# EAGLE schematic FLYTE-v1 (EAGLE 9.6.2)
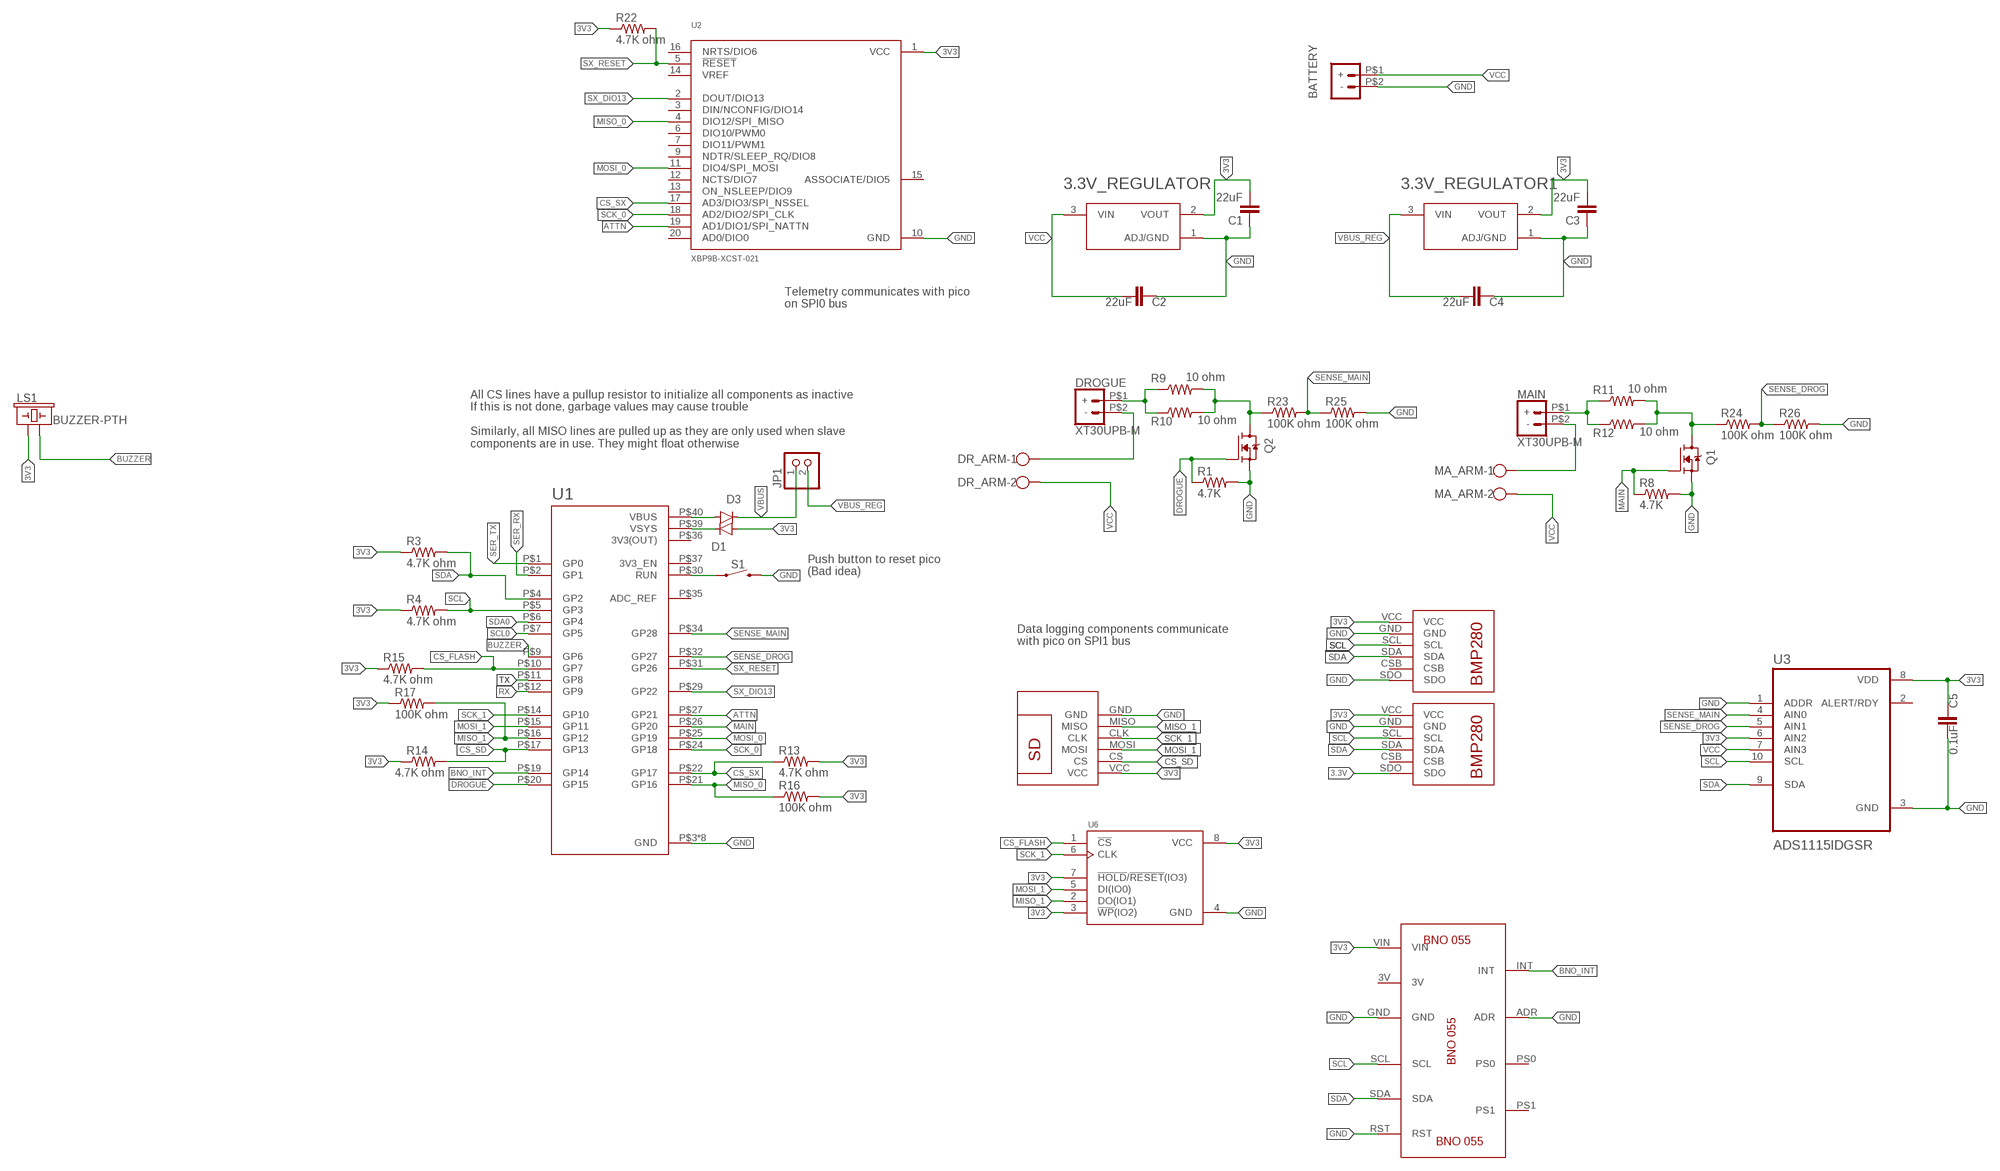
[diagram p0: schematic, sheet 1]

## Parts
3.3V_REGULATOR  AMS1117-3.3  [SOT229P700X180-4N]
3.3V_REGULATOR1  AMS1117-3.3  [SOT229P700X180-4N]
BATTERY  XT30UPB-M  [XT30UPB-M]
C1  22uF  22UF-0805-6.3V-20%  [0805]
C2  22uF  22UF-0805-6.3V-20%  [0805]
C3  22uF  22UF-0805-6.3V-20%  [0805]
C4  22uF  22UF-0805-6.3V-20%  [0805]
C5  0.1uF  22UF-0805-6.3V-20%  [0805]
D1  1N4004  [DO41-10]
D3  1N4004  [DO41-10]
DR_ARM  W237-102  [W237-102]
DROGUE  XT30UPB-M  [XT30UPB-M]
JP1  PINHD-1X2  [1X02]
LS1  BUZZER-PTH  [BUZZER-12MM]
MA_ARM  W237-102  [W237-102]
MAIN  XT30UPB-M  [XT30UPB-M]
Q1  IRF540NPBF  [TO254P1054X469X1930-3]
Q2  IRF540NPBF  [TO254P1054X469X1930-3]
R1  4.7K  R-US_R0805  [R0805]
R3  4.7K ohm  R-US_R0805  [R0805]
R4  4.7K ohm  R-US_R0805  [R0805]
R8  4.7K  R-US_R0805  [R0805]
R9  10 ohm  R-US_0207/10  [0207/10]
R10  10 ohm  R-US_0207/10  [0207/10]
R11  10 ohm  R-US_0207/10  [0207/10]
R12  10 ohm  R-US_0207/10  [0207/10]
R13  4.7K ohm  R-US_R0805  [R0805]
R14  4.7K ohm  R-US_R0805  [R0805]
R15  4.7K ohm  R-US_R0805  [R0805]
R16  100K ohm  R-US_R0805  [R0805]
R17  100K ohm  R-US_R0805  [R0805]
R22  4.7K ohm  R-US_R0805  [R0805]
R23  100K ohm  R-US_R0805  [R0805]
R24  100K ohm  R-US_R0805  [R0805]
R25  100K ohm  R-US_R0805  [R0805]
R26  100K ohm  R-US_R0805  [R0805]
S1  MOMENTARY-SWITCH-SPST-PTH-6.0MM  [TACTILE_SWITCH_PTH_6.0MM]
U1  RASPBERRY_PICO-NO_DEBUG  [PICO-PKG-NO_DEBUG]
U2  XBP9B-XCST-021  [DIP2200W51P200L3294H279Q20P]
U3  ADS1115IDGSR  [SOP50P490X110-10N]
U6  W25Q32JVSSIQ  [SOIC127P790X216-8N]
U$1  BMP280  [BMP280]
U$2  BMP280  [BMP280]
U$3  SDREADER  [SDREADER]
U$4  BNO055  [BNO055]

## Nets
3.3V: U$2.SDO
3V3: 3.3V_REGULATOR1.2(VOUT) 3.3V_REGULATOR.2(VOUT) C1.2 C3.2 C5.1 D1.A LS1.+ R3.1 R4.1 R13.2 R14.1 R15.1 R16.2 R17.1 R22.1 U2.1(VCC) U3.6(AIN2) U3.8(VDD) U6.3(!WP!(IO2)) U6.7(!HOLD!/!RESET!(IO3)) U6.8(VCC) U$1.VCC U$2.VCC U$3.VCC U$4.VIN
ATTN: U1.P$27(GP21) U2.19(AD1/DIO1/SPI_NATTN)
BNO_INT: U1.P$19(GP14) U$4.INT
BUZZER: LS1.- U1.P$9(GP6)
CS_FLASH: R15.2 U1.P$10(GP7) U6.1(!CS)
CS_SD: R14.2 U1.P$17(GP13) U$3.CS
CS_SX: R13.1 U1.P$22(GP17) U2.17(AD3/DIO3/SPI_NSSEL)
DROGUE: Q2.1(G) R1.1 U1.P$20(GP15)
GND: 3.3V_REGULATOR1.1(ADJ/GND) 3.3V_REGULATOR.1(ADJ/GND) BATTERY.P$2(-) C1.1 C2.1 C3.1 C4.1 C5.2 Q1.3(S) Q2.3(S) R1.2 R8.2 R25.2 R26.2 S1.3 U1.P$3(GND) U1.P$8(GND) U1.P$13(GND) U1.P$18(GND) U1.P$23(GND) U1.P$28(GND) U1.P$33(GND) U1.P$38(GND) U2.10(GND) U3.1(ADDR) U3.3(GND) U6.4(GND) U$1.GND U$1.SDO U$2.GND U$3.GND U$4.ADR U$4.GND U$4.RST
MAIN: Q1.1(G) R8.1 U1.P$26(GP20)
MISO_0: R16.1 U1.P$21(GP16) U2.4(DIO12/SPI_MISO)
MISO_1: R17.2 U1.P$16(GP12) U6.2(DO(IO1)) U$3.MISO
MOSI_0: U1.P$25(GP19) U2.11(DIO4/SPI_MOSI)
MOSI_1: U1.P$15(GP11) U6.5(DI(IO0)) U$3.MOSI
N$1: D1.C U1.P$39(VSYS)
N$2: DR_ARM.1 DROGUE.P$2(-)
N$6: MAIN.P$1(+) R11.1 R12.1
N$7: DROGUE.P$1(+) R9.1 R10.1
N$8: S1.1 U1.P$30(RUN)
N$12: Q2.2(D) R9.2 R10.2 R23.1
N$13: Q1.2(D) R11.2 R12.2 R24.1
N$14: MA_ARM.1 MAIN.P$2(-)
N$17: D3.A U1.P$40(VBUS)
RX: U1.P$12(GP9)
SCK_0: U1.P$24(GP18) U2.18(AD2/DIO2/SPI_CLK)
SCK_1: U1.P$14(GP10) U6.6(CLK) U$3.CLK
SCL: R4.2 U1.P$5(GP3) U3.10(SCL) U$1.SCL U$2.SCL U$4.SCL
SCL0: U1.P$7(GP5)
SDA: R3.2 U1.P$4(GP2) U3.9(SDA) U$1.SDA U$2.SDA U$4.SDA
SDA0: U1.P$6(GP4)
SENSE_DROG: R24.2 R26.1 U1.P$32(GP27) U3.5(AIN1)
SENSE_MAIN: R23.2 R25.1 U1.P$34(GP28) U3.4(AIN0)
SER_RX: U1.P$2(GP1)
SER_TX: U1.P$1(GP0)
SX_DIO13: U1.P$29(GP22) U2.2(DOUT/DIO13)
SX_RESET: R22.2 U1.P$31(GP26) U2.5(!RESET)
TX: U1.P$11(GP8)
VBUS: D3.C JP1.1
VBUS_REG: 3.3V_REGULATOR1.3(VIN) C4.2 JP1.2
VCC: 3.3V_REGULATOR.3(VIN) BATTERY.P$1(+) C2.2 DR_ARM.2 MA_ARM.2 U3.7(AIN3)
Unconnected: U1.P$35(ADC_REF) U1.P$37(3V3_EN) U2.3(DIN/NCONFIG/DIO14) U2.6(DIO10/PWM0) U2.7(DIO11/PWM1) U2.9(NDTR/SLEEP_RQ/DIO8) U2.12(NCTS/DIO7) U2.13(ON_NSLEEP/DIO9) U2.14(VREF) U2.15(ASSOCIATE/DIO5) U2.16(NRTS/DIO6) U2.20(AD0/DIO0) U3.2(ALERT/RDY) U$1.CSB U$2.CSB U$4.3V U$4.PS0 U$4.PS1

## Notes on the sheet
- Telemetry communicates with pico 
  on SPI0 bus
- All CS lines have a pullup resistor to initialize all components as inactive
  If this is not done, garbage values may cause trouble
  
  Similarly, all MISO lines are pulled up as they are only used when slave
  components are in use. They might float otherwise
- Push button to reset pico
  (Bad idea)
- Data logging components communicate 
  with pico on SPI1 bus

## Power pins joined to a net without a drawn wire
3V3(OUT): U1.P$36(3V3(OUT))

## Library data of the parts
3.3V_REGULATOR 3.3V_REGULATOR1 = AMS1117-3.3:AMS1117-3.3: Sot223/Pkg 1-Amp 3.3-Volt Low Drop Out Voltage Regulatator Check availability <https://pricing.snapeda.com/parts/AMS1117-3.3/Advanced%20Monolithic%20Systems/view-part?ref=eda>; AVAILABILITY: Not in stock; DESCRIPTION: Sot223/Pkg 1-Amp 3.3-Volt Low Drop Out Voltage Regulatator; MF: Advanced Monolithic Systems; MP: AMS1117-3.3; PACKAGE: SOT-223 Seeed Technology; PRICE: None
BATTERY DROGUE MAIN = XT30UPB-M:XT30UPB-M: Check availability <https://pricing.snapeda.com/parts/XT30UPB-M/amass/view-part?ref=eda>; AVAILABILITY: Not in stock; DESCRIPTION: Socket; DC supply; XT30; male; PIN: 2; on PCBs; THT; yellow; 15A; 500V; MF: amass; MP: XT30UPB-M; PACKAGE: None; PRICE: None
C1-C4 = SparkFun-Capacitors:22UF: 22µF ceramic capacitors A capacitor is a passive two-terminal electrical component used to store electrical energy temporarily in an electric field.; PROD_ID: CAP-08402
C5 = SparkFun-Capacitors:22UF: 22µF ceramic capacitors A capacitor is a passive two-terminal electrical component used to store electrical energy temporarily in an electric field.; PROD_ID: CAP-08402; VALUE: 22uF
D1 D3 = diode:1N4004: DIODE general purpose rectifier, 1 A
DR_ARM MA_ARM = con-wago-500:W237-102: WAGO SCREW CLAMP; MPN: 237-102; OC_FARNELL: unknown; OC_NEWARK: 70K9898
JP1 = pinhead:PINHD-1X2: PIN HEADER
LS1 = SparkFun-Electromechanical:BUZZER: Buzzer Small round buzzers that operate around the audible 2kHz range. You can use these as speakers to create simple music or user interfaces. Variant Overview: PTH - Mini Speaker - PC Mount 12mm 2.048kHz <https://www.sparkfun.com/products/7950> PTH_KIT - Mini Speaker - PC Mount 12mm 2.048kHz <https://www.sparkfun.com/products/7950> KIT simplifies soldering by adding stop mask to one side of the pads. PTH_NO_SILK - Mini Speaker - PC Mount 12mm 2.048kHz <https://www.sparkfun.com/products/7950> No silkscreen indicator of buzzer outline. PTH_KIT_NO_SILK - Mini Speaker - PC Mount 12mm 2.048kHz <https://www.sparkfun.com/products/7950> KIT package w/o silkscreen SMD - Buzzer Audio Magnetic (CCV-084B16) SMD buzzer used on, e.g. the LilyPad Buzzer <https://www.sparkfun.com/products/8463> and RFID USB Reader <https://www.sparkfun.com/products/9963>. SMD_KIT - Buzzer Audio Magnetic (CCV-084B16) SMD Buzzer with elongated pins to make soldering easier. Used on the SparkFun Simon Says - Surface Mount Soldering Kit <https://www.sparkfun.com/products/10935>. SMD-SQUARE - Buzzer Audio Magnetic (COMP-15701) SMT square buzzer with one chamfered corner.; PROD_ID: COMP-08253; SF_SKU: COM-07950
Q1 Q2 = IRF540NPBF:IRF540NPBF: Check availability <https://pricing.snapeda.com/parts/IRF540NPBF/Infineon/view-part?ref=eda>; AVAILABILITY: In Stock; DESCRIPTION: RoHS Compliant | Low RDS(on) | Industry-leading quality | Dynamic dv/dt Rating | Fast Switching | Fully Avalanche Rated | 175C Operating Temperature; MF: Infineon; MP: IRF540NPBF; PACKAGE: TO-220 Infineon; PRICE: None; PURCHASE-URL: https://pricing.snapeda.com/search/part/IRF540NPBF/?ref=eda
R1 R3 R4 R8-R17 R22-R26 = rcl:R-US_: RESISTOR, American symbol; SPICEPREFIX: R
S1 = SparkFun-Switches:MOMENTARY-SWITCH-SPST: Momentary Switch (Pushbutton) - SPST Normally-open (NO) SPST momentary switches (buttons, pushbuttons). Variants PTH-12MM - 12mm square, through-hole Momentary Pushbutton Switch - 12mm Square <https://www.sparkfun.com/products/9190> (COM-09190) PTH-6.0MM, PTH-6.0MM-KIT - 6.0mm square, through-hole Mini Pushbutton Switch <https://www.sparkfun.com/products/97> (COM-00097) KIT package intended for soldering kit's - only one side of pads' copper is exposed. PTH-RIGHT-ANGLE-KIT - Right-angle, through-hole Right Angle Tactile Button <https://www.sparkfun.com/products/10791> - Used on SparkFun BigTime Watch Kit <https://www.sparkfun.com/products/11734> SMD-12MM - 12mm square, surface-mount Tactile Button - SMD (12mm) <https://www.sparkfun.com/products/12993> (COM-12993) Used on SparkFun PicoBoard <https://www.sparkfun.com/products/11888> SMD-4.5MM - 4.5mm Square Trackball Switch Used on SparkFun Blackberry Trackballer Breakout <https://www.sparkfun.com/products/13169> SMD-4.6MMX2.8MM - 4.60mm x 2.80mm, surface mount Used on SparkFun Pro Micro - RP2040 <https://www.sparkfun.com/products/17717> SMD-5.2MM, SMD-5.2-REDUNDANT - 5.2mm square, surface-mount Mini Pushbutton Switch - SMD <https://www.sparkfun.com/products/8720> (COM-08720) Used on Arduino Pro Mini <https://www.sparkfun.com/products/11114> REDUNDANT package connects both switch circuits together SMD-6.0X3.5MM - 6.0 x 3.5mm, surface mount Momentary Reset Switch SMD <https://www.sparkfun.com/products/8229> (COM-08229) SMD-6.2MM-TALL - 6.2mm square, surface mount Tactile Button - SMD (6mm) <https://www.sparkfun.com/products/12992> Used on SparkFun Digital Sandbox <https://www.sparkfun.com/products/12651> SMD-RIGHT-ANGLE - Right-angle, surface mount Used on SparkFun Block for Intel® Edison - Arduino <https://www.sparkfun.com/products/13036>; PROD_ID: SWCH-08441; SF_SKU: COM-00097
U1 = RpiPico:RASPBERRY_PICO-NO_DEBUG
U2 = XBP9B-XCST-021:XBP9B-XCST-021: XBee-PRO 900HP DigiMesh 900 MHz 200 Kbps RF Module with U.FL Connector Check availability <https://pricing.snapeda.com/parts/XBP9B-XCST-021/Digi%20International/view-part?ref=eda>; AVAILABILITY: In Stock; CHECK_PRICES: https://www.snapeda.com/parts/XBP9B-XCST-021/Digi+International/view-part/?ref=eda; DESCRIPTION: General ISM < 1GHz - Transceiver Module 920MHz Antenna Not Included, RP-SMA Through Hole; MF: Digi International; MP: XBP9B-XCST-021; PACKAGE: Module Digi International; PRICE: None; PURCHASE-URL: https://www.snapeda.com/api/url_track_click_mouser/?unipart_id=521579&manufacturer=Digi International&part_name=XBP9B-XCST-021&search_term=None; SNAPEDA_LINK: https://www.snapeda.com/parts/XBP9B-XCST-021/Digi+International/view-part/?ref=snap
U3 = ADS1115IDGSR:ADS1115IDGSR: Check availability <https://pricing.snapeda.com/parts/ADS1115IDGSR/Texas%20Instruments/view-part?ref=eda>; AVAILABILITY: In Stock; CHECK_PRICES: https://www.snapeda.com/parts/ADS1115IDGSR/Texas+Instruments/view-part/?ref=eda; DESCRIPTION: 16-bit, 860-SPS, 4-channel, delta-sigma ADC with PGA, oscillator, VREF, comparator and I2C; MF: Texas Instruments; MP: ADS1115IDGSR; PACKAGE: VSSOP-10 Texas Instruments; PRICE: None; PURCHASE-URL: https://www.snapeda.com/api/url_track_click_mouser/?unipart_id=45903&manufacturer=Texas Instruments&part_name=ADS1115IDGSR&search_term=ads1115; SNAPEDA_LINK: https://www.snapeda.com/parts/ADS1115IDGSR/Texas+Instruments/view-part/?ref=snap
U6 = W25Q32JVSSIQ:W25Q32JVSSIQ: NOR Flash Serial-SPI 3V/3.3V 32M-bit 4M x 8 8.5ns 8-Pin SOIC Check availability <https://pricing.snapeda.com/parts/W25Q32JVSSIQ/Winbond/view-part?ref=eda>; AVAILABILITY: In Stock; DESCRIPTION: FLASH - NOR Memory IC 32Mb (4M x 8) SPI - Quad I/O 133 MHz 8-SOIC; MF: Winbond; MP: W25Q32JVSSIQ; PACKAGE: SOIC-8 Winbond; PRICE: None; PURCHASE-URL: https://pricing.snapeda.com/search/part/W25Q32JVSSIQ/?ref=eda
U$1 U$2 = BMP280:BMP280
U$3 = SDREADER:SDREADER
U$4 = BNO055:BNO055